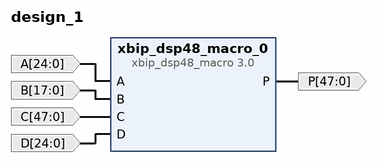
[diagram p0: block diagram of the top level]
# Vivado block design design_1, xc7z010clg400-1, Vivado 2019.2
create_bd_design design_1

create_bd_port -dir I -from 24 -to 0 -type data A
create_bd_port -dir I -from 17 -to 0 -type data B
create_bd_port -dir I -from 47 -to 0 -type data C
create_bd_port -dir O -from 47 -to 0 -type data P
create_bd_port -dir I -from 24 -to 0 -type data D

create_bd_cell -type ip -vlnv xilinx.com:ip:xbip_dsp48_macro:3.0 xbip_dsp48_macro_0
set_property -dict [list \
  CONFIG.a_width 25 \
  CONFIG.areg_3 false \
  CONFIG.areg_4 false \
  CONFIG.breg_3 false \
  CONFIG.breg_4 false \
  CONFIG.c_width 48 \
  CONFIG.creg_3 false \
  CONFIG.creg_4 false \
  CONFIG.creg_5 false \
  CONFIG.d_width 25 \
  CONFIG.dreg_3 false \
  CONFIG.instruction1 {(A+D)*B-C} \
  CONFIG.instruction2 {#} \
  CONFIG.instruction3 {#} \
  CONFIG.instruction4 {#} \
  CONFIG.instruction5 {#} \
  CONFIG.instruction6 {#} \
  CONFIG.instruction7 {#} \
  CONFIG.instruction8 {#} \
  CONFIG.mreg_5 false \
  CONFIG.p_binarywidth 0 \
  CONFIG.p_full_width 48 \
  CONFIG.p_width 48 \
  CONFIG.pipeline_options By_Tier \
  CONFIG.preg_6 false \
  CONFIG.show_filtered false \
  CONFIG.tier_3 false \
] [get_bd_cells xbip_dsp48_macro_0]

# ---- connections ----

connect_bd_net -net A_0_1 [get_bd_ports A] [get_bd_pins xbip_dsp48_macro_0/A]
connect_bd_net -net B_0_1 [get_bd_ports B] [get_bd_pins xbip_dsp48_macro_0/B]
connect_bd_net -net C_0_1 [get_bd_ports C] [get_bd_pins xbip_dsp48_macro_0/C]
connect_bd_net [get_bd_pins xbip_dsp48_macro_0/P] [get_bd_ports P]
connect_bd_net -net D_0_1 [get_bd_ports D] [get_bd_pins xbip_dsp48_macro_0/D]

validate_bd_design
save_bd_design
